# EAGLE design UCube_v2_Led1 (EAGLE 6.1)
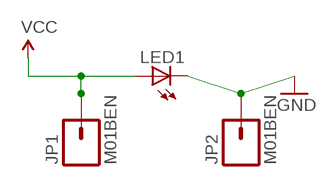
[diagram p0: schematic, sheet 1]

## Parts
JP1  M01BEN  [1X01-BEN]
JP2  M01BEN  [1X01-BEN]
LED1  LED5MM  [LED5MM]

## Nets
GND: JP2.1 LED1.K(C)
VCC: JP1.1 LED1.A

## Library data of the parts
JP1 JP2 = SparkFun2:M01: Header 1 Standard 1-pin 0.1" header. Use with straight break away headers (SKU : PRT-00116), right angle break away headers (PRT-00553), swiss pins (PRT-00743), machine pins (PRT-00117), and female headers (PRT-00115).
LED1 = SparkFun:LED: LEDs Standard schematic elements and footprints for 5mm, 3mm, 1206, and 0603 sized LEDs. 5mm - Spark Fun Electronics SKU : COM-00529 (and others)

## Board
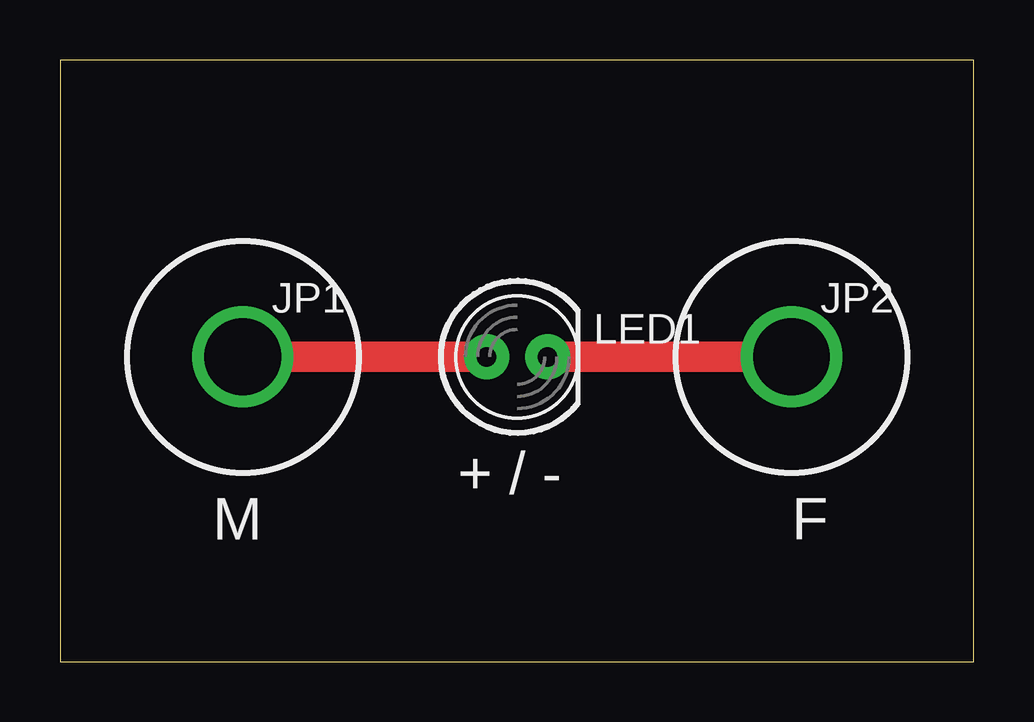
[diagram p1: board, top side]

Size 38.08 x 25.07 mm. Coordinates in mm from the lower left corner, seen from the top.
Outline: 0,0 38.08,0 38.08,25.07 0,25.07 0,0
Copper layers (1*16): Top 0.035mm / dielectric 1.5mm / Bottom 0.035mm
Design rules: minimum track width 8mil, minimum drill 20mil, track to track 8mil, track to pad 8mil, pad to pad 8mil, via to via 8mil, smd to smd 8mil, copper to edge 10mil, drill to drill 8mil, minimum pad ring 12mil, minimum via ring 10mil, stop-mask expansion 4mil, vias tented up to drill 25mil, thermal gap 10mil

### Footprints (pad centres in the part's own frame; a part is rotated, then mirrored left to right if it is on the bottom)
1X01-BEN = drill 3.2: 1 0,0
LED5MM = drill 0.813 pad 1.88: A -1.27,0; K 1.27,0

### Placement (x,y rotation side)
JP1  7.62,12.7 0 top
JP2  30.48,12.7 0 top
LED1  19.05,12.7 0 top

### Tracks (layer width: path | path; a pad name or v marks a point on that pad's centre or on a via)
GND
  Top 1.27: LED1.K JP2.1
VCC
  Top 1.27: LED1.A JP1.1

### Text on the board
tPlace: + / - | M | F